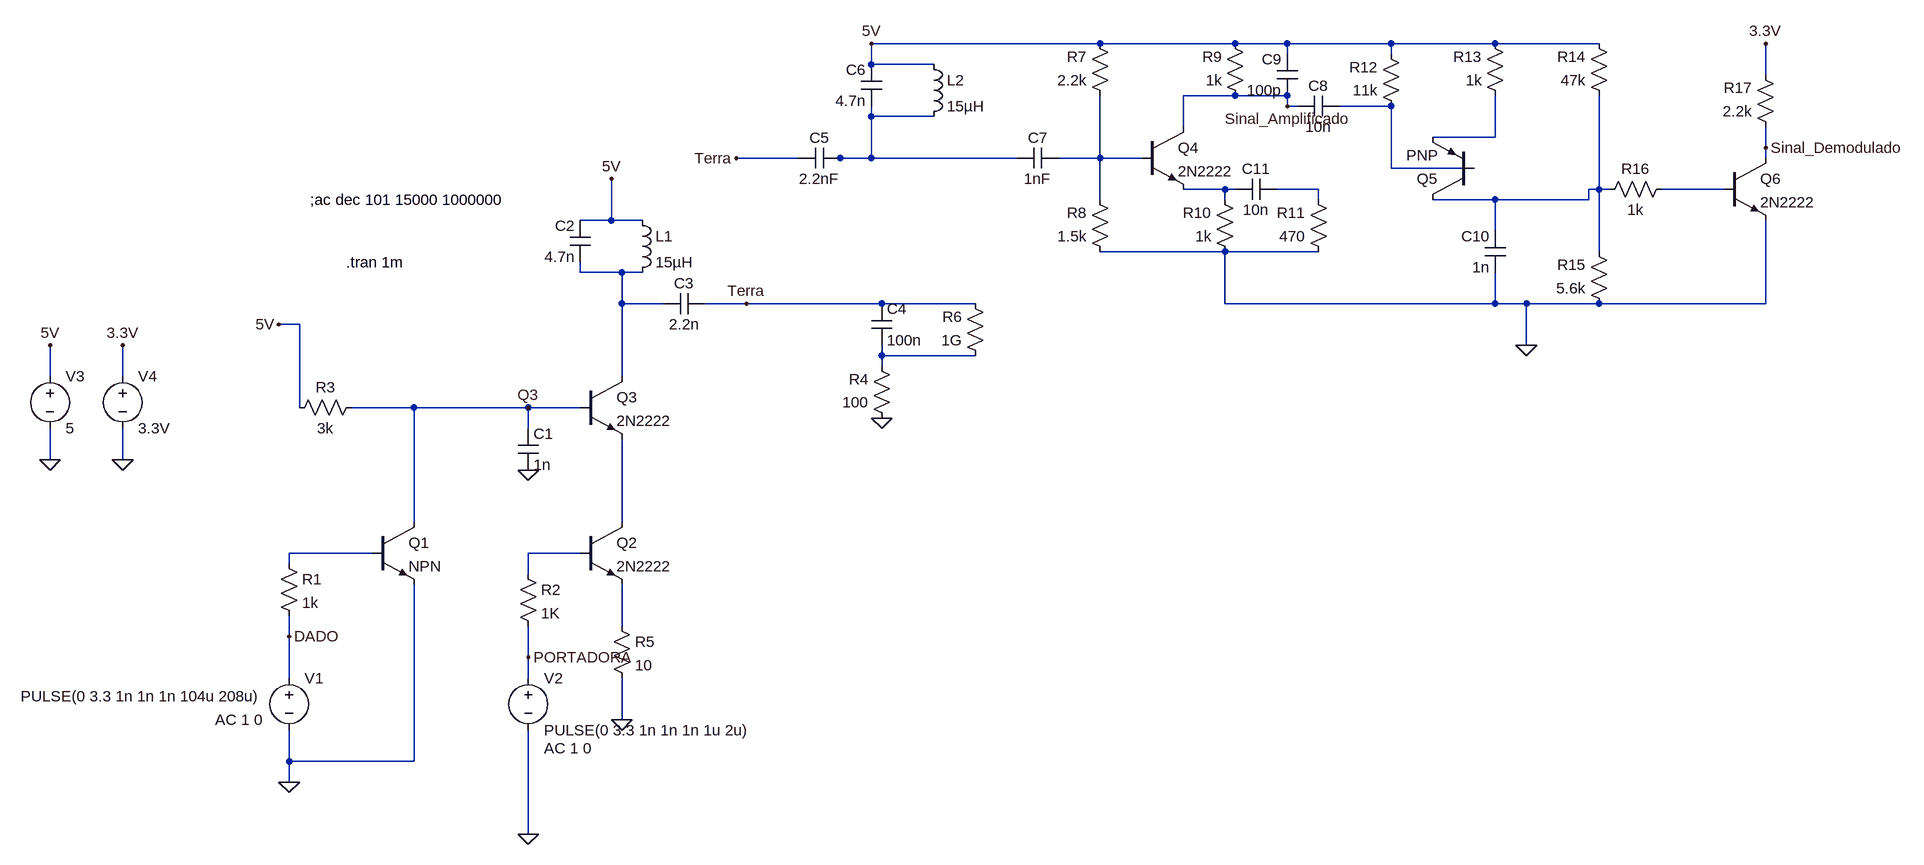
[diagram p0: schematic PLC_circuit.asc]
PLC_circuit.asc, the LTspice schematic file:
Version 4
SHEET 1 2384 700
WIRE 1200 -560 848 -560
WIRE 1408 -560 1200 -560
WIRE 1488 -560 1408 -560
WIRE 1648 -560 1488 -560
WIRE 1808 -560 1648 -560
WIRE 1968 -560 1808 -560
WIRE 1488 -544 1488 -560
WIRE 1648 -544 1648 -560
WIRE 848 -528 848 -560
WIRE 944 -528 848 -528
WIRE 2224 -512 2224 -560
WIRE 1408 -480 1328 -480
WIRE 1488 -480 1408 -480
WIRE 1488 -464 1488 -480
WIRE 1504 -464 1488 -464
WIRE 1648 -464 1568 -464
WIRE 848 -448 848 -464
WIRE 944 -448 848 -448
WIRE 1328 -432 1328 -480
WIRE 1808 -416 1808 -480
WIRE 1808 -416 1712 -416
WIRE 2224 -400 2224 -432
WIRE 736 -384 640 -384
WIRE 800 -384 784 -384
WIRE 848 -384 848 -448
WIRE 848 -384 800 -384
WIRE 1072 -384 848 -384
WIRE 1200 -384 1200 -480
WIRE 1200 -384 1136 -384
WIRE 1264 -384 1200 -384
WIRE 2224 -384 2224 -400
WIRE 1648 -368 1648 -464
WIRE 1776 -368 1648 -368
WIRE 1392 -336 1328 -336
WIRE 1408 -336 1392 -336
WIRE 1536 -336 1472 -336
WIRE 1968 -336 1968 -480
WIRE 1968 -336 1952 -336
WIRE 1984 -336 1968 -336
WIRE 2160 -336 2064 -336
WIRE 1200 -320 1200 -384
WIRE 1392 -320 1392 -336
WIRE 1536 -320 1536 -336
WIRE 1808 -320 1712 -320
WIRE 1952 -320 1952 -336
WIRE 1952 -320 1808 -320
WIRE 448 -288 448 -352
WIRE 448 -288 400 -288
WIRE 496 -288 448 -288
WIRE 1808 -272 1808 -320
WIRE 1392 -240 1200 -240
WIRE 1536 -240 1392 -240
WIRE 1968 -240 1968 -336
WIRE 400 -208 400 -224
WIRE 464 -208 400 -208
WIRE 496 -208 464 -208
WIRE 464 -160 464 -208
WIRE 528 -160 464 -160
WIRE 656 -160 592 -160
WIRE 864 -160 656 -160
WIRE 1008 -160 864 -160
WIRE 1392 -160 1392 -240
WIRE 1808 -160 1808 -208
WIRE 1808 -160 1392 -160
WIRE 1856 -160 1808 -160
WIRE 1968 -160 1856 -160
WIRE 2224 -160 2224 -288
WIRE 2224 -160 1968 -160
WIRE -32 -128 -64 -128
WIRE 1856 -96 1856 -160
WIRE 864 -80 864 -96
WIRE 1008 -80 864 -80
WIRE 864 -64 864 -80
WIRE -416 -48 -416 -96
WIRE -304 -48 -304 -96
WIRE 464 -48 464 -160
WIRE -32 0 -32 -128
WIRE 144 0 48 0
WIRE 320 0 144 0
WIRE 400 0 320 0
WIRE 320 32 320 0
WIRE -416 80 -416 32
WIRE -304 80 -304 32
WIRE 144 176 144 0
WIRE 464 176 464 48
WIRE 80 224 -48 224
WIRE 400 224 320 224
WIRE -48 240 -48 224
WIRE 320 256 320 224
WIRE 464 336 464 272
WIRE -48 352 -48 320
WIRE 320 384 320 336
WIRE -48 416 -48 352
WIRE 320 416 320 384
WIRE 464 480 464 416
WIRE -48 544 -48 496
WIRE 144 544 144 272
WIRE 144 544 -48 544
WIRE -48 576 -48 544
WIRE 320 656 320 496
FLAG -48 576 0
FLAG 464 480 0
FLAG 320 96 0
FLAG 864 16 0
FLAG -416 80 0
FLAG -416 -96 5V
FLAG -64 -128 5V
FLAG 320 384 PORTADORA
FLAG 656 -160 Terra
FLAG -48 352 DADO
FLAG 320 0 Q3
FLAG 848 -560 5V
FLAG 1856 -96 0
FLAG -304 80 0
FLAG -304 -96 3.3V
FLAG 2224 -560 3.3V
FLAG 1488 -464 Sinal_Amplificado
FLAG 2224 -400 Sinal_Demodulado
FLAG 448 -352 5V
FLAG 640 -384 Terra
FLAG 320 656 0
SYMBOL npn 80 176 R0
SYMATTR InstName Q1
SYMBOL npn 400 176 R0
SYMATTR InstName Q2
SYMATTR Value 2N2222
SYMBOL npn 400 -48 R0
SYMATTR InstName Q3
SYMATTR Value 2N2222
SYMBOL res -64 224 R0
SYMATTR InstName R1
SYMATTR Value 1k
SYMBOL res 304 240 R0
SYMATTR InstName R2
SYMATTR Value 1K
SYMBOL res 64 -16 R90
WINDOW 0 0 56 VBottom 2
WINDOW 3 32 56 VTop 2
SYMATTR InstName R3
SYMATTR Value 3k
SYMBOL cap 304 32 R0
SYMATTR InstName C1
SYMATTR Value 1n
SYMBOL cap 416 -224 R180
WINDOW 0 24 56 Left 2
WINDOW 3 24 8 Left 2
SYMATTR InstName C2
SYMATTR Value 4.7n
SYMATTR SpiceLine Rpar=100
SYMBOL ind 480 -304 R0
SYMATTR InstName L1
SYMATTR Value 15µH
SYMATTR SpiceLine Rser=0.95
SYMBOL cap 848 -160 R0
SYMATTR InstName C4
SYMATTR Value 100n
SYMBOL res 880 32 R180
WINDOW 0 36 76 Left 2
WINDOW 3 36 40 Left 2
SYMATTR InstName R4
SYMATTR Value 100
SYMBOL voltage -48 400 R0
WINDOW 123 -114 80 Left 2
WINDOW 39 0 0 Left 0
WINDOW 3 -413 44 Left 2
SYMATTR Value2 AC 1 0
SYMATTR InstName V1
SYMATTR Value PULSE(0 3.3 1n 1n 1n 104u 208u)
SYMBOL voltage 320 400 R0
WINDOW 123 24 124 Left 2
WINDOW 39 0 0 Left 0
SYMATTR Value2 AC 1 0
SYMATTR InstName V2
SYMATTR Value PULSE(0 3.3 1n 1n 1n 1u 2u)
SYMBOL voltage -416 -64 R0
WINDOW 123 0 0 Left 0
WINDOW 39 24 124 Left 2
SYMATTR InstName V3
SYMATTR Value 5
SYMBOL res 1024 -64 R180
WINDOW 0 36 76 Left 2
WINDOW 3 36 40 Left 2
SYMATTR InstName R6
SYMATTR Value 1G
SYMBOL cap 800 -400 R90
WINDOW 0 0 32 VBottom 2
WINDOW 3 32 32 VTop 2
SYMATTR InstName C5
SYMATTR Value 2.2nF
SYMBOL cap 864 -464 R180
WINDOW 0 24 56 Left 2
WINDOW 3 24 8 Left 2
SYMATTR InstName C6
SYMATTR Value 4.7n
SYMATTR SpiceLine Rpar=100
SYMBOL ind 928 -544 R0
SYMATTR InstName L2
SYMATTR Value 15µH
SYMATTR SpiceLine Rser=0.95
SYMBOL cap 1136 -400 R90
WINDOW 0 0 32 VBottom 2
WINDOW 3 32 32 VTop 2
SYMATTR InstName C7
SYMATTR Value 1nF
SYMBOL res 1216 -464 R180
WINDOW 0 36 76 Left 2
WINDOW 3 36 40 Left 2
SYMATTR InstName R7
SYMATTR Value 2.2k
SYMBOL res 1216 -224 R180
WINDOW 0 36 76 Left 2
WINDOW 3 36 40 Left 2
SYMATTR InstName R8
SYMATTR Value 1.5k
SYMBOL npn 1264 -432 R0
SYMATTR InstName Q4
SYMATTR Value 2N2222
SYMBOL res 1424 -464 R180
WINDOW 0 36 76 Left 2
WINDOW 3 36 40 Left 2
SYMATTR InstName R9
SYMATTR Value 1k
SYMBOL res 1408 -224 R180
WINDOW 0 36 76 Left 2
WINDOW 3 36 40 Left 2
SYMATTR InstName R10
SYMATTR Value 1k
SYMBOL res 1552 -224 R180
WINDOW 0 36 76 Left 2
WINDOW 3 36 40 Left 2
SYMATTR InstName R11
SYMATTR Value 470
SYMBOL cap 1568 -480 R90
WINDOW 0 0 32 VBottom 2
WINDOW 3 32 32 VTop 2
SYMATTR InstName C8
SYMATTR Value 10n
SYMBOL cap 1504 -480 R180
WINDOW 0 24 56 Left 2
WINDOW 3 24 8 Left 2
SYMATTR InstName C9
SYMATTR Value 100p
SYMBOL res 1664 -448 R180
WINDOW 0 36 76 Left 2
WINDOW 3 36 40 Left 2
SYMATTR InstName R12
SYMATTR Value 11k
SYMBOL pnp 1776 -320 R180
SYMATTR InstName Q5
SYMBOL res 1824 -464 R180
WINDOW 0 36 76 Left 2
WINDOW 3 36 40 Left 2
SYMATTR InstName R13
SYMATTR Value 1k
SYMBOL cap 1824 -208 R180
WINDOW 0 24 56 Left 2
WINDOW 3 24 8 Left 2
SYMATTR InstName C10
SYMATTR Value 1n
SYMBOL res 1984 -464 R180
WINDOW 0 36 76 Left 2
WINDOW 3 36 40 Left 2
SYMATTR InstName R14
SYMATTR Value 47k
SYMBOL res 1984 -144 R180
WINDOW 0 36 76 Left 2
WINDOW 3 36 40 Left 2
SYMATTR InstName R15
SYMATTR Value 5.6k
SYMBOL res 1968 -320 R270
WINDOW 0 32 56 VTop 2
WINDOW 3 0 56 VBottom 2
SYMATTR InstName R16
SYMATTR Value 1k
SYMBOL npn 2160 -384 R0
SYMATTR InstName Q6
SYMATTR Value 2N2222
SYMBOL res 2240 -416 R180
WINDOW 0 36 76 Left 2
WINDOW 3 36 40 Left 2
SYMATTR InstName R17
SYMATTR Value 2.2k
SYMBOL cap 1472 -352 R90
WINDOW 0 0 32 VBottom 2
WINDOW 3 32 32 VTop 2
SYMATTR InstName C11
SYMATTR Value 10n
SYMBOL voltage -304 -64 R0
WINDOW 123 0 0 Left 0
WINDOW 39 0 0 Left 0
SYMATTR InstName V4
SYMATTR Value 3.3V
SYMBOL res 448 320 R0
SYMATTR InstName R5
SYMATTR Value 10
SYMBOL cap 592 -176 R90
WINDOW 0 0 32 VBottom 2
WINDOW 3 32 32 VTop 2
SYMATTR InstName C3
SYMATTR Value 2.2n
TEXT -16 -320 Left 2 !;ac dec 101 15000 1000000
TEXT 40 -224 Left 2 !.tran 1m

The netlist it stands for:
* PLC_circuit.asc
Q1 Q3 N012 0 0 NPN
Q2 N011 N013 N014 0 2N2222
Q3 N009 Q3 N011 0 2N2222
R1 N012 DADO 1k
R2 N013 PORTADORA 1K
R3 Q3 5V 3k
C1 Q3 0 1n
C2 N009 5V 4.7n Rpar=100
L1 5V N009 15µH Rser=0.95
C4 Terra N010 100n
R4 0 N010 100
V1 DADO 0 PULSE(0 3.3 1n 1n 1n 104u 208u) AC 1 0
V2 PORTADORA 0 PULSE(0 3.3 1n 1n 1n 1u 2u) AC 1 0
V3 5V 0 5
R6 N010 Terra 1G
C5 N002 Terra 2.2nF
C6 N002 5V 4.7n Rpar=100
L2 5V N002 15µH Rser=0.95
C7 N004 N002 1nF
R7 N004 5V 2.2k
R8 0 N004 1.5k
Q4 Sinal_Amplificado N004 N005 0 2N2222
R9 Sinal_Amplificado 5V 1k
R10 0 N005 1k
R11 0 N006 470
C8 N001 Sinal_Amplificado 10n
C9 Sinal_Amplificado 5V 100p
R12 N001 5V 11k
Q5 N007 N001 N003 0 PNP
R13 N003 5V 1k
C10 0 N007 1n
R14 N007 5V 47k
R15 0 N007 5.6k
R16 N007 N008 1k
Q6 Sinal_Demodulado N008 0 0 2N2222
R17 Sinal_Demodulado 3.3V 2.2k
C11 N006 N005 10n
V4 3.3V 0 3.3V
R5 N014 0 10
C3 Terra N009 2.2n
.model NPN NPN
.model PNP PNP
.lib standard.bjt
;ac dec 101 15000 1000000
.tran 1m
.backanno
.end